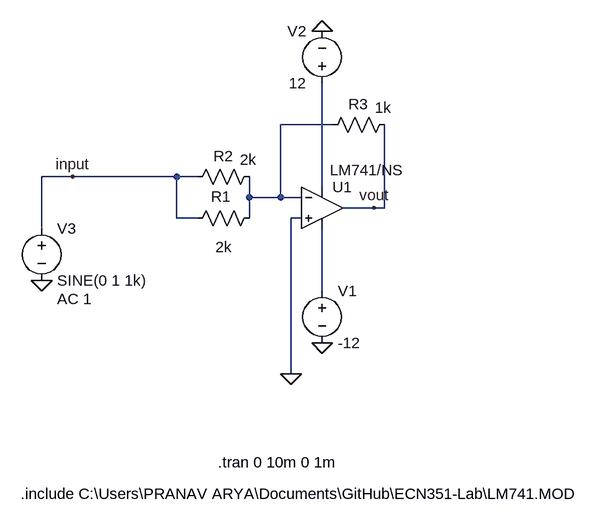
[diagram p0: schematic Avrager.asc]
Avrager.asc, the LTspice schematic file:
Version 4
SHEET 1 880 680
WIRE 288 -96 208 -96
WIRE -112 -16 -160 -16
WIRE 48 -16 -112 -16
WIRE 80 -16 48 -16
WIRE 272 0 272 -160
WIRE 160 16 160 -16
WIRE 208 16 208 -96
WIRE 208 16 160 16
WIRE 240 16 208 16
WIRE 352 32 304 32
WIRE 368 32 368 -96
WIRE 368 32 352 32
WIRE 48 48 48 -16
WIRE 80 48 48 48
WIRE 160 48 160 16
WIRE 240 48 224 48
WIRE -160 64 -160 -16
WIRE 272 160 272 64
WIRE 224 288 224 48
FLAG 272 240 0
FLAG 272 -240 0
FLAG -160 144 0
FLAG 224 288 0
FLAG 352 32 vout
FLAG -112 -16 input
SYMBOL OpAmps\\opamp2 272 -32 R0
WINDOW 3 12 6 Left 2
SYMATTR Value LM741/NS
SYMATTR InstName U1
SYMBOL voltage 272 144 R0
WINDOW 123 0 0 Left 0
WINDOW 39 0 0 Left 0
SYMATTR InstName V1
SYMATTR Value -12
SYMBOL voltage 272 -144 R180
WINDOW 0 24 96 Left 2
WINDOW 3 24 16 Left 2
WINDOW 123 0 0 Left 0
WINDOW 39 0 0 Left 0
SYMATTR InstName V2
SYMATTR Value 12
SYMBOL res 176 32 R90
WINDOW 0 -2 60 VBottom 2
WINDOW 3 45 55 VTop 2
SYMATTR InstName R1
SYMATTR Value 2k
SYMBOL res 176 -32 R90
WINDOW 0 0 56 VBottom 2
WINDOW 3 -26 18 VTop 2
SYMATTR InstName R2
SYMATTR Value 2k
SYMBOL voltage -160 48 R0
WINDOW 123 24 124 Left 2
WINDOW 39 0 0 Left 0
SYMATTR Value2 AC 1
SYMATTR InstName V3
SYMATTR Value SINE(0 1 1k)
SYMBOL res 384 -112 R90
WINDOW 0 0 56 VBottom 2
WINDOW 3 -26 18 VTop 2
SYMATTR InstName R3
SYMATTR Value 1k
TEXT -192 472 Left 2 !.include C:\\Users\\PRANAV ARYA\\Documents\\GitHub\\ECN351-Lab\\LM741.MOD
TEXT 112 424 Left 2 !.tran 0 10m 0 1m

The netlist it stands for:
* Avrager.asc
XU1 0 N001 N002 N003 vout LM741/NS  ; pins In+ In- V+ V- OUT
V1 N003 0 -12
V2 N002 0 12
R1 N001 input 2k
R2 N001 input 2k
V3 input 0 SINE(0 1 1k) AC 1
R3 vout N001 1k
.include C:\Users\PRANAV ARYA\Documents\GitHub\ECN351-Lab\LM741.MOD
.tran 0 10m 0 1m
.backanno
.end